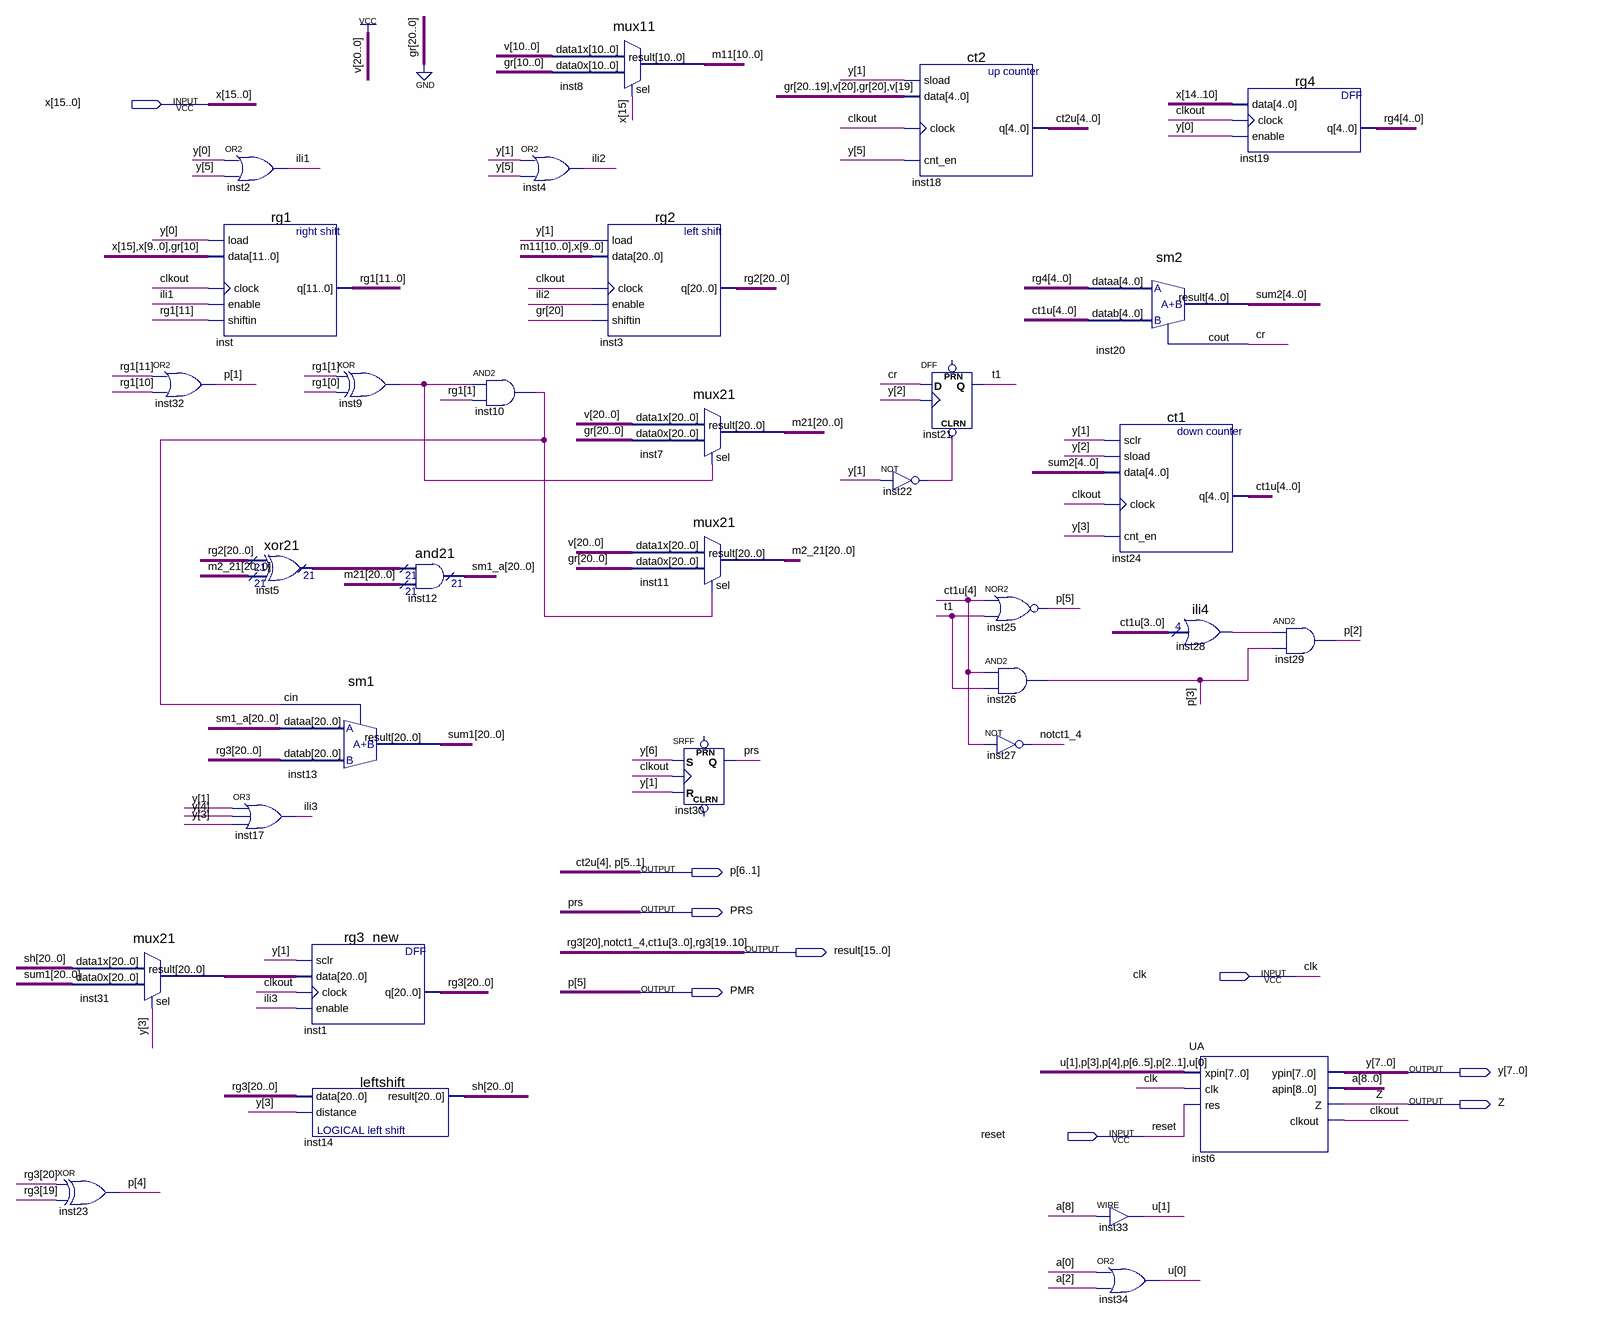
[diagram p0: schematic sheet]
// Quartus schematic OA.bdf as structural Verilog: 33 symbols, 9 pins
module OA (
  input  [15:0] x,
  input  clk,
  input  reset,
  output [6:1] p,
  output PRS,
  output [15:0] result,
  output PMR,
  output [7:0] y,
  output Z
);

  wire clkout, cr, ili1, ili2, ili3, inst9_out, inst10_out, inst22_out, inst28_result, t1;
  wire [1:0] u;
  wire [3:0] ct2u;
  wire [4:0] rg4, sum2;
  wire [4:4] ct1u;
  wire [8:0] a;
  wire [9:0] rg3;
  wire [10:0] m11;
  wire [11:0] rg1;
  wire [20:0] inst5_result, inst31_result, m2_21, m21, rg2, sh, sm1_a, sum1;

  xor inst23 (p[4], result[15], result[9]);
  mux21 inst31 (.data1x(sh), .data0x(sum1), .sel(y[3]), .result(inst31_result));
  or inst32 (p[1], rg1[11], rg1[10]);
  or inst2 (ili1, y[0], y[5]);
  rg1 inst (.load(y[0]), .data({x[15], x[9:0], 1'b0}), .clock(clkout), .enable(ili1), .shiftin(rg1[11]), .q(rg1));
  xor21 inst5 (.data0x(rg2), .data1x(m2_21), .result(inst5_result));
  or inst17 (ili3, y[1], y[4], y[3]);
  sm1 inst13 (.dataa(sm1_a), .datab({result[15], result[9:0], rg3}), .cin(inst10_out), .result(sum1));
  rg3_new inst1 (.sclr(y[1]), .data(inst31_result), .clock(clkout), .enable(ili3), .q({result[15], result[9:0], rg3}));
  leftshift inst14 (.data({result[15], result[9:0], rg3}), .distance(y[3]), .result(sh));
  xor inst9 (inst9_out, rg1[1], rg1[0]);
  and21 inst12 (.data0x(inst5_result), .data1x(m21), .result(sm1_a));
  and inst10 (inst10_out, inst9_out, rg1[1]);
  mux11 inst8 (.data1x({11{1'b1}}), .data0x({11{1'b0}}), .sel(x[15]), .result(m11));
  or inst4 (ili2, y[1], y[5]);
  rg2 inst3 (.load(y[1]), .data({m11, x[9:0]}), .clock(clkout), .enable(ili2), .shiftin(1'b0), .q(rg2));
  mux21 inst7 (.data1x({21{1'b1}}), .data0x({21{1'b0}}), .sel(inst9_out), .result(m21));
  mux21 inst11 (.data1x({21{1'b1}}), .data0x({21{1'b0}}), .sel(inst10_out), .result(m2_21));
  SRFF inst30 (.S(y[6]), .R(y[1]), .CLK(clkout), .Q(PRS));  // open: PRN, CLRN
  not inst22 (inst22_out, y[1]);
  ct2 inst18 (.sload(y[1]), .data(5'b00101), .clock(clkout), .cnt_en(y[5]), .q({p[6], ct2u}));
  DFF inst21 (.CLRN(inst22_out), .CLK(y[2]), .D(cr), .Q(t1));  // open: PRN
  nor inst25 (p[5], ct1u[4], t1);
  and inst26 (p[3], ct1u[4], t1);
  not inst27 (result[14], ct1u[4]);
  sm2 inst20 (.dataa(rg4), .datab({ct1u[4], result[13:10]}), .result(sum2), .cout(cr));
  ct1 inst24 (.sclr(y[1]), .sload(y[2]), .data(sum2), .clock(clkout), .cnt_en(y[3]), .q({ct1u[4], result[13:10]}));
  assign u[1] = a[8];  // WIRE inst33
  or inst34 (u[0], a[0], a[2]);
  ili4 inst28 (.data(result[13:10]), .result(inst28_result));
  UA inst6 (
    .xpin({u[1], p[3], p[4], p[6:5], p[2:1], u[0]}), .clk(clk), .res(reset), .ypin(y), .apin(a), .Z(Z),
    .clkout(clkout));
  rg4 inst19 (.data(x[14:10]), .clock(clkout), .enable(y[0]), .q(rg4));
  and inst29 (p[2], inst28_result, p[3]);

  assign PMR = p[5];

  // Other names for the same wires on the sheet: ct1u[3:0] = result[13:10]; ct2u[4] = p[6]; notct1_4 = result[14];
  //   rg3[20:10] = {result[15], result[9:0]}
endmodule
